# Altium schematic sheet FPGA Supply.SchDoc: SVPXFMC Carrier 3U
size 420 x 297 mm; CheckedBy: \; Author: G.Kasprowicz; CompanyName: ISE; DrawnBy: T.Przywozki; Organization: WUT ISE; Address1: Warsaw University of Technology; Address2: Nowowiejska 15/19 00-665 Warsaw; Revision: 1.0.; SheetNumber: 6; SheetTotal: 20; Projet: SVPXFMC Carrier 3U; ModifiedBy: -; CheckedDate: -; Title2: FPGA Supply; DivGrp: ISE; Designer: G. Kasprowicz; Project: SVPXFMC Carrier 3U
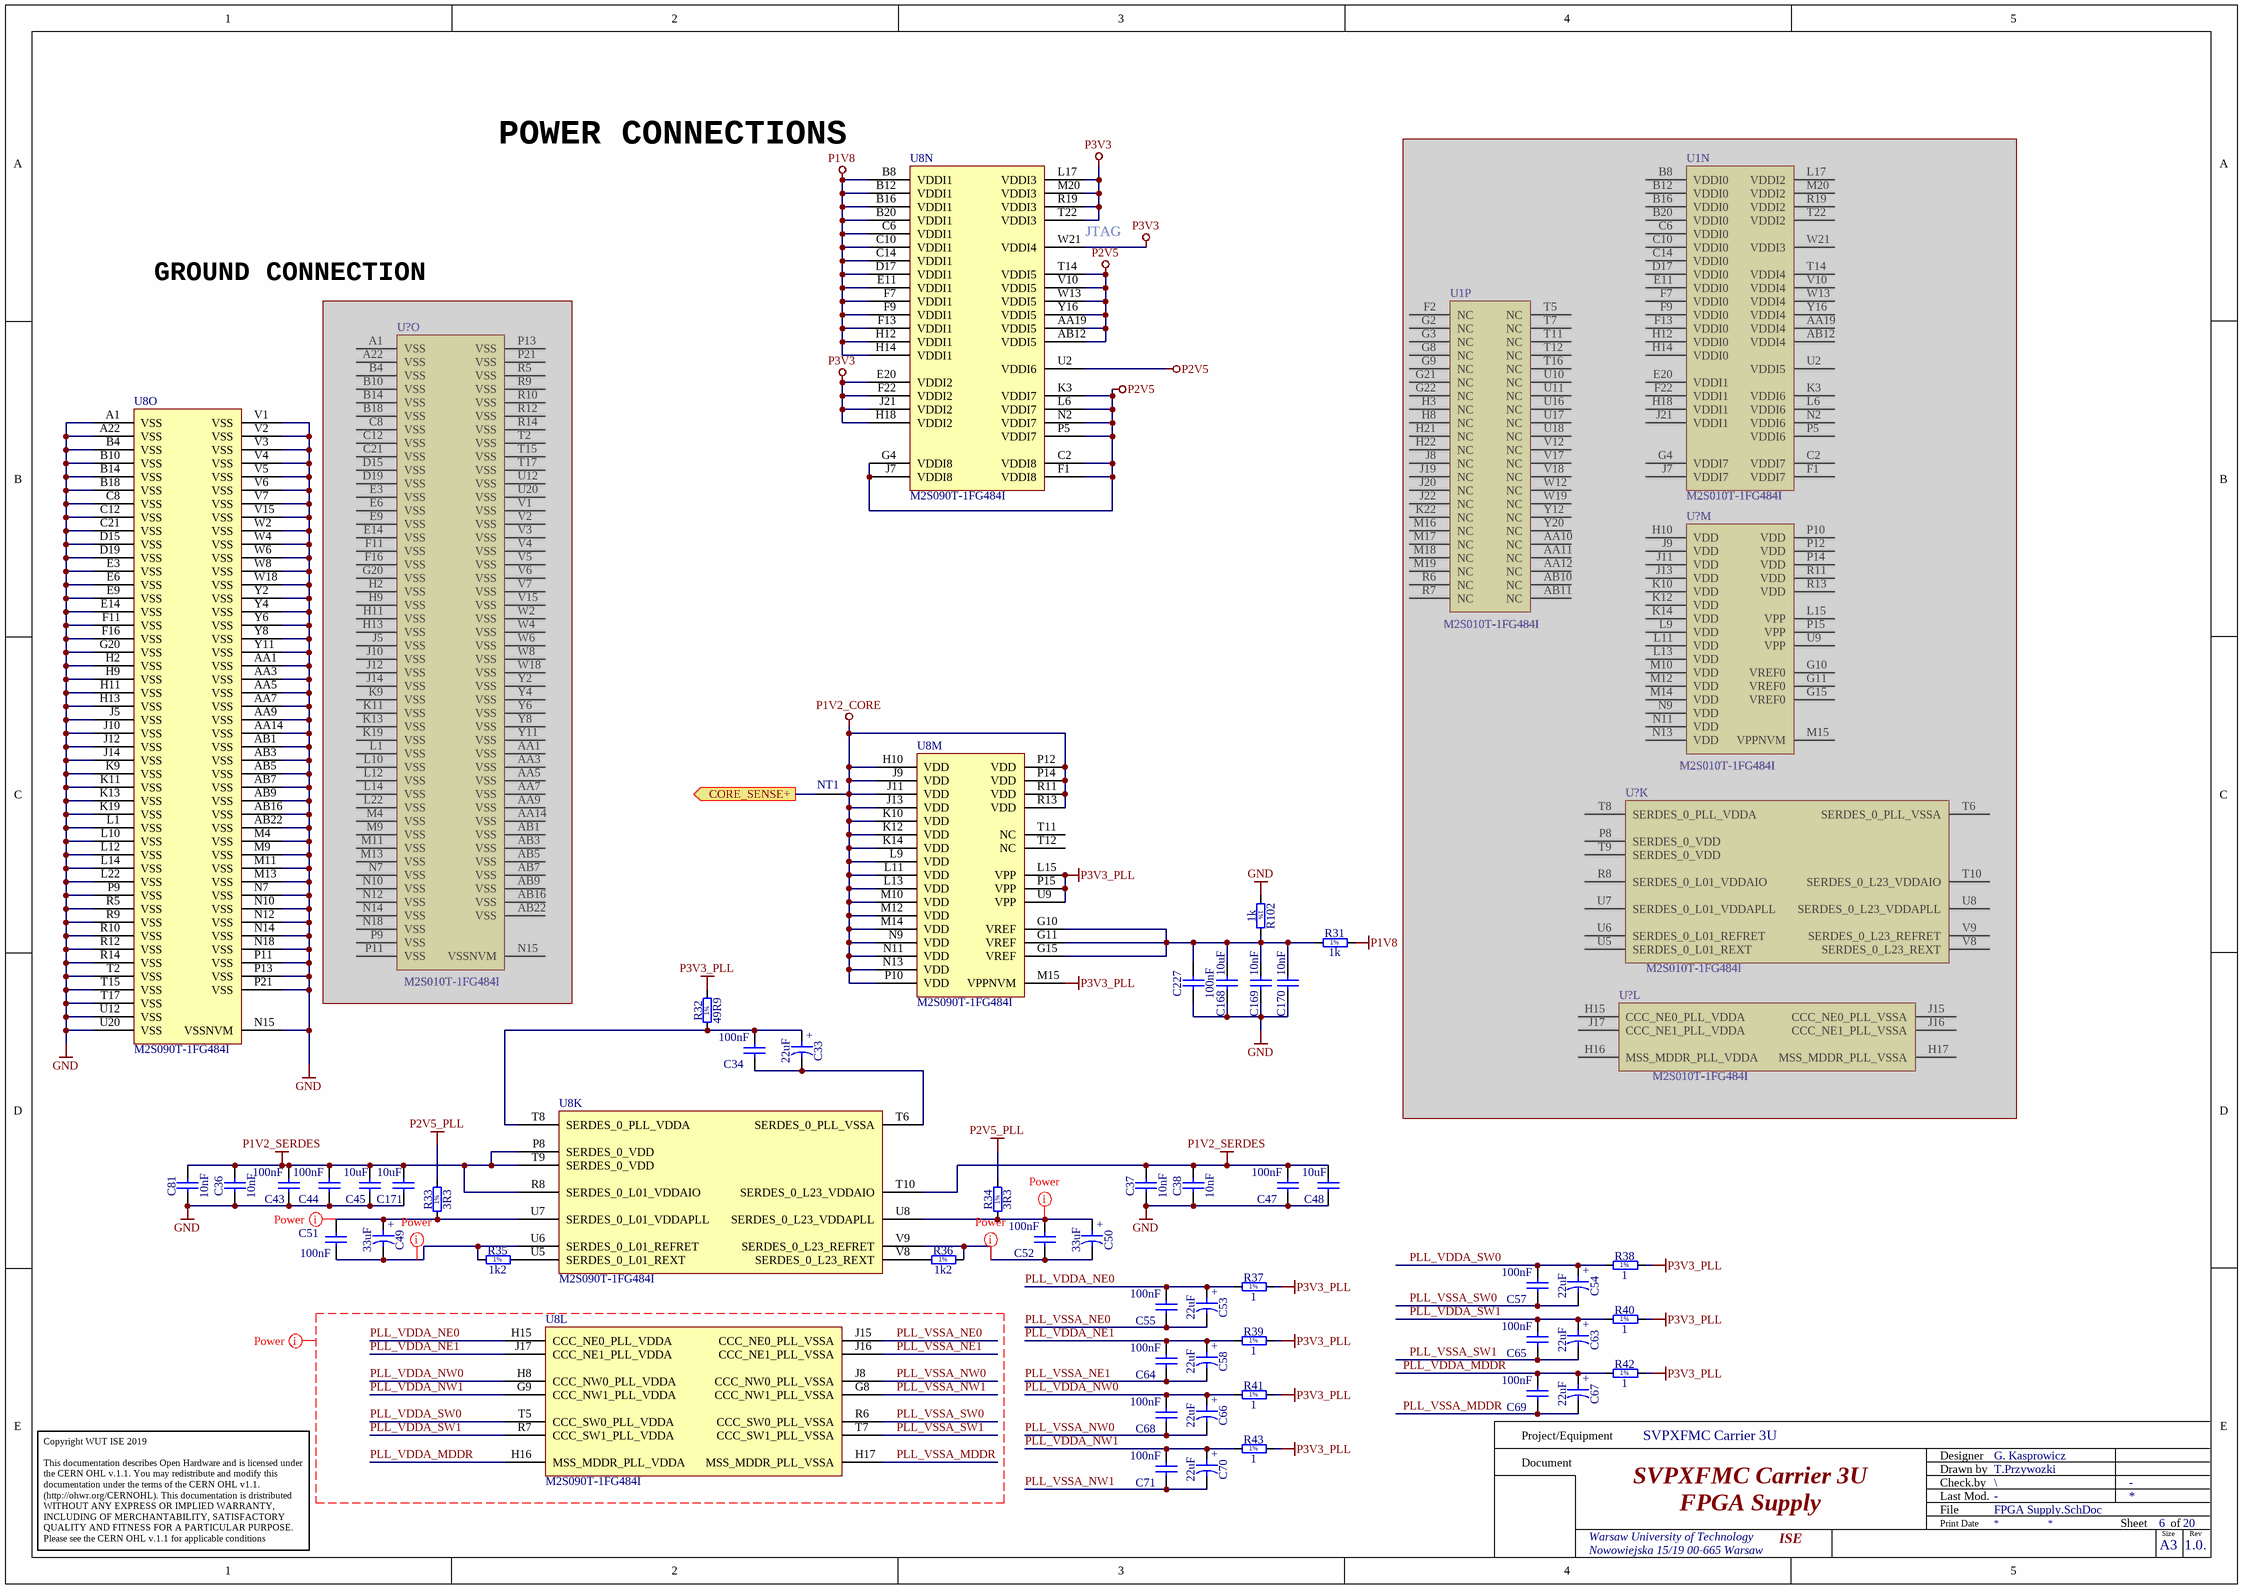
[diagram p0: FPGA Supply.SchDoc]

## Parts
(Parts that share a designator on the sheet are numbered #1, #2 ... from top to bottom, then left to right.)
C33  22uF  [CAPMP3216X180N]
C34  100nF  [CAPC0603X33N]
C36  10nF  [CAPC1005X55N]
C37  10nF  [CAPC1005X55N]
C38  10nF  [CAPC1005X55N]
C43  100nF  [CAPC0603X33N]
C44  100nF  [CAPC0603X33N]
C45  10uF  [CAPC1608X80N]
C47  100nF  [CAPC0603X33N]
C48  10uF  [CAPC1608X80N]
C49  33uF  [CAPMP3216X180N]
C50  33uF  [CAPMP3216X180N]
C51  100nF  [CAPC0603X33N]
C52  100nF  [CAPC0603X33N]
C53  22uF  [CAPMP3216X180N]
C54  22uF  [CAPMP3216X180N]
C55  100nF  [CAPC0603X33N]
C57  100nF  [CAPC0603X33N]
C58  22uF  [CAPMP3216X180N]
C63  22uF  [CAPMP3216X180N]
C64  100nF  [CAPC0603X33N]
C65  100nF  [CAPC0603X33N]
C66  22uF  [CAPMP3216X180N]
C67  22uF  [CAPMP3216X180N]
C68  100nF  [CAPC0603X33N]
C69  100nF  [CAPC0603X33N]
C70  22uF  [CAPMP3216X180N]
C71  100nF  [CAPC0603X33N]
C81  10nF  [CAPC1005X55N]
C168  10uF  [CAPC1608X80N]
C169  10nF  [CAPC0603X33N]
C170  10nF  [CAPC0603X33N]
C171  10uF  [CAPC1608X80N]
C227  100nF  [CAPC0603X33N]
NT1  Net Tie  [Net Tie]  (value not drawn)  (net tie, no BOM)
R31  1k  [RESC1005X40N]
R32  49R9  [RESC1005X40N]
R33  3R3  [RESC1005X40N]
R34  3R3  [RESC1005X40N]
R35  1k2  [RESC1005X40N]
R36  1k2  [RESC1005X40N]
R37  1  [RESC1005X40N]
R38  1  [RESC1005X40N]
R39  1  [RESC1005X40N]
R40  1  [RESC1005X40N]
R41  1  [RESC1005X40N]
R42  1  [RESC1005X40N]
R43  1  [RESC1005X40N]
R102  1k  [RESC1005X40N]
U1  M2S010T-1FG484I  [MCSM-FG-484_V]  (parts N,P of 16)  (masked out: inside a compile mask, not in the netlist)
U8  M2S090T-1FG484I  [MCSM-FG-484_V]  (parts K,L,M,N,O of 15)
U?#1  M2S010T-1FG484I  [MCSM-FG-484_V]  (part O of 16)  (masked out: inside a compile mask, not in the netlist)
U?#2  M2S010T-1FG484I  [MCSM-FG-484_V]  (part M of 16)  (masked out: inside a compile mask, not in the netlist)
U?#3  M2S010T-1FG484I  [MCSM-FG-484_V]  (part K of 16)  (masked out: inside a compile mask, not in the netlist)
U?#4  M2S010T-1FG484I  [MCSM-FG-484_V]  (part L of 16)  (masked out: inside a compile mask, not in the netlist)

## Ports
CORE_SENSE+ (out)

## Nets
GND: C36.1 C37.1 C38.1 C43.1 C44.1 C45.1 C47.1 C48.1 C81.1 C168.1 C169.1 C170.1 C171.1 C227.1 R102.1 U8.A1(VSS) U8.A22(VSS) U8.AA1(VSS) U8.AA3(VSS) U8.AA5(VSS) U8.AA7(VSS) U8.AA9(VSS) U8.AA14(VSS) U8.AB1(VSS) U8.AB3(VSS) U8.AB5(VSS) U8.AB7(VSS) U8.AB9(VSS) U8.AB16(VSS) U8.AB22(VSS) U8.B4(VSS) U8.B10(VSS) U8.B14(VSS) U8.B18(VSS) U8.C8(VSS) U8.C12(VSS) U8.C21(VSS) U8.D15(VSS) U8.D19(VSS) U8.E3(VSS) U8.E6(VSS) U8.E9(VSS) U8.E14(VSS) U8.F11(VSS) U8.F16(VSS) U8.G20(VSS) U8.H2(VSS) U8.H9(VSS) U8.H11(VSS) U8.H13(VSS) U8.J5(VSS) U8.J10(VSS) U8.J12(VSS) U8.J14(VSS) U8.K9(VSS) U8.K11(VSS) U8.K13(VSS) U8.K19(VSS) U8.L1(VSS) U8.L10(VSS) U8.L12(VSS) U8.L14(VSS) U8.L22(VSS) U8.M4(VSS) U8.M9(VSS) U8.M11(VSS) U8.M13(VSS) U8.N7(VSS) U8.N10(VSS) U8.N12(VSS) U8.N14(VSS) U8.N15(VSSNVM) U8.N18(VSS) U8.P9(VSS) U8.P11(VSS) U8.P13(VSS) U8.P21(VSS) U8.R5(VSS) U8.R9(VSS) U8.R10(VSS) U8.R12(VSS) U8.R14(VSS) U8.T2(VSS) U8.T15(VSS) U8.T17(VSS) U8.U12(VSS) U8.U20(VSS) U8.V1(VSS) U8.V2(VSS) U8.V3(VSS) U8.V4(VSS) U8.V5(VSS) U8.V6(VSS) U8.V7(VSS) U8.V15(VSS) U8.W2(VSS) U8.W4(VSS) U8.W6(VSS) U8.W8(VSS) U8.W18(VSS) U8.Y2(VSS) U8.Y4(VSS) U8.Y6(VSS) U8.Y8(VSS) U8.Y11(VSS)
P1V2_CORE: NT1.2 U8.H10(VDD) U8.J9(VDD) U8.J11(VDD) U8.J13(VDD) U8.K10(VDD) U8.K12(VDD) U8.K14(VDD) U8.L9(VDD) U8.L11(VDD) U8.L13(VDD) U8.M10(VDD) U8.M12(VDD) U8.M14(VDD) U8.N9(VDD) U8.N11(VDD) U8.N13(VDD) U8.P10(VDD) U8.P12(VDD) U8.P14(VDD) U8.R11(VDD) U8.R13(VDD)
P1V2_SERDES: C36.2 C37.2 C38.2 C43.2 C44.2 C45.2 C47.2 C48.2 C81.2 C171.2 U8.P8(SERDES_0_VDD) U8.R8(SERDES_0_L01_VDDAIO) U8.T9(SERDES_0_VDD) U8.T10(SERDES_0_L23_VDDAIO)
P1V8: R31.2 U8.B8(VDDI1) U8.B12(VDDI1) U8.B16(VDDI1) U8.B20(VDDI1) U8.C6(VDDI1) U8.C10(VDDI1) U8.C14(VDDI1) U8.D17(VDDI1) U8.E11(VDDI1) U8.F7(VDDI1) U8.F9(VDDI1) U8.F13(VDDI1) U8.H12(VDDI1) U8.H14(VDDI1)
P2V5: U8.AA19(VDDI5) U8.AB12(VDDI5) U8.C2(VDDI8) U8.F1(VDDI8) U8.G4(VDDI8) U8.J7(VDDI8) U8.K3(VDDI7) U8.L6(VDDI7) U8.N2(VDDI7) U8.P5(VDDI7) U8.T14(VDDI5) U8.U2(VDDI6) U8.V10(VDDI5) U8.W13(VDDI5) U8.Y16(VDDI5)
P2V5_PLL: R33.2 R34.2
P3V3: U8.E20(VDDI2) U8.F22(VDDI2) U8.H18(VDDI2) U8.J21(VDDI2) U8.L17(VDDI3) U8.M20(VDDI3) U8.R19(VDDI3) U8.T22(VDDI3) U8.W21(VDDI4)
P3V3_PLL: R32.2 R37.2 R38.2 R39.2 R40.2 R41.2 R42.2 R43.2 U8.L15(VPP) U8.M15(VPPNVM) U8.P15(VPP) U8.U9(VPP)
CORE_SENSE+: NT1.1 ; port CORE_SENSE+
PLL_VDDA_MDDR: C67.1 C69.2 R42.1 U8.H16(MSS_MDDR_PLL_VDDA)
PLL_VDDA_NE0: C53.1 C55.2 R37.1 U8.H15(CCC_NE0_PLL_VDDA)
PLL_VDDA_NE1: C58.1 C64.2 R39.1 U8.J17(CCC_NE1_PLL_VDDA)
PLL_VDDA_NW0: C66.1 C68.2 R41.1 U8.H8(CCC_NW0_PLL_VDDA)
PLL_VDDA_NW1: C70.1 C71.2 R43.1 U8.G9(CCC_NW1_PLL_VDDA)
PLL_VDDA_SW0: C54.1 C57.2 R38.1 U8.T5(CCC_SW0_PLL_VDDA)
PLL_VDDA_SW1: C63.1 C65.2 R40.1 U8.R7(CCC_SW1_PLL_VDDA)
PLL_VSSA_MDDR: C67.2 C69.1 U8.H17(MSS_MDDR_PLL_VSSA)
PLL_VSSA_NE0: C53.2 C55.1 U8.J15(CCC_NE0_PLL_VSSA)
PLL_VSSA_NE1: C58.2 C64.1 U8.J16(CCC_NE1_PLL_VSSA)
PLL_VSSA_NW0: C66.2 C68.1 U8.J8(CCC_NW0_PLL_VSSA)
PLL_VSSA_NW1: C70.2 C71.1 U8.G8(CCC_NW1_PLL_VSSA)
PLL_VSSA_SW0: C54.2 C57.1 U8.R6(CCC_SW0_PLL_VSSA)
PLL_VSSA_SW1: C63.2 C65.1 U8.T7(CCC_SW1_PLL_VSSA)
NetC33_1: C33.1 C34.2 R32.1 U8.T8(SERDES_0_PLL_VDDA)
NetC33_2: C33.2 C34.1 U8.T6(SERDES_0_PLL_VSSA)
NetC49_1: C49.1 C51.2 R33.1 U8.U7(SERDES_0_L01_VDDAPLL)
NetC49_2: C49.2 C51.1 R35.1 U8.U6(SERDES_0_L01_REFRET)
NetC50_1: C50.1 C52.2 R34.1 U8.U8(SERDES_0_L23_VDDAPLL)
NetC50_2: C50.2 C52.1 R36.2 U8.V9(SERDES_0_L23_REFRET)
NetC168_2: C168.2 C169.2 C170.2 C227.2 R31.1 R102.2 U8.G10(VREF) U8.G11(VREF) U8.G15(VREF)
NetR35_2: R35.2 U8.U5(SERDES_0_L01_REXT)
NetR36_1: R36.1 U8.V8(SERDES_0_L23_REXT)

Not connected (* = marked no-connect by the designer): U8 T11(NC) T12(NC)

## Layout directives
net class Power: NetC49_1, NetC49_2, NetC50_1, NetC50_2
net class Power; net class Power_CCC: PLL_VDDA_MDDR, PLL_VDDA_NE0, PLL_VDDA_NE1, PLL_VDDA_NW0, PLL_VDDA_NW1, PLL_VDDA_SW0, PLL_VDDA_SW1, PLL_VSSA_MDDR, PLL_VSSA_NE0, PLL_VSSA_NE1, PLL_VSSA_NW0, PLL_VSSA_NW1, PLL_VSSA_SW0, PLL_VSSA_SW1

## Notes on the sheet
- POWER CONNECTIONS
- (near U8) JTAG
- GROUND CONNECTION
- Project/Equipment
- Document
- Designer
- Drawn by
- Check.by
- File
- Last Mod.
- Print Date
- Sheet
- Size
- A3
- of
- Rev
- Copyright WUT ISE 2019
  This documentation describes Open Hardware and is licensed under the CERN OHL v.1.1. You may redistribute and modify this documentation under the terms of the CERN OHL v1.1.
  (http://ohwr.org/CERNOHL). This documentation is dristributed WITHOUT ANY EXPRESS OR IMPLIED WARRANTY, INCLUDING OF MERCHANTABILITY, SATISFACTORY QUALITY AND FITNESS FOR A PARTICULAR PURPOSE. Please see the CERN OHL v.1.1 for applicable conditions
- (in symbol CTE3216-18_22UF_10V_10%) +
- (in symbol CTE3216-18_33UF_4V_10%) +
- (in symbol R0402_1K2_1%_0.0625W_100PPM) 1%
- (in symbol R0402_1K_1%_0.0625W_100PPM) 1%
- (in symbol R0402_1R_1%_0.0625W_200PPM) 1%
- (in symbol R0402_3R3_1%_0.0625W_200PPM) 1%
- (in symbol R0402_49R9_1%_0.0625W_100PPM) 1%

## Library data of the parts
C33 C53 C54 C58 C63 C66 C67 C70 = CTE3216-18_22UF_10V_10%: Polarised capacitor; Part Description: Solid Tantalum Chip Capacitor; Manufacturer: GENERIC; Manufacturer1 Part Number: TAJA226K010R; Voltage: 10V; Tolerance: ±10%; Part Number: CTE3216-18_22UF_10V_10%; Component Kind: Standard; Component Type: Standard; Pin Count: 2; Value: 22uF; Status: Preferred; Manufacturer Part Number: CTE3216-18_22UF_10V_10%; Case: A; Mounted: Yes; Socket: No; SMD: Yes; Sense: No; Manufacturer1 Example: AVX; Manufacturer1 ComponentHeight: 1.8mm; HelpURL: \\cern.ch\dfs\Applications\Altium\Datasheets\CTE_AVX_TAJ.pdf; Author: CERN DEM JLC; CreateDate: 03/12/2007; LatestRevisionDate: 03/12/2007
C34 C43 C44 C47 C51 C52 C55 C57 C64 C65 C68 C69 C71 C227 = CC0201_100NF_6.3V_10%_X5R: Non-polarised capacitor; Manufacturer: GENERIC; Part Description: SMD Multilayer Chip Ceramic Capacitor; Manufacturer1 Part Number: 02016D104KAT2A; Voltage: 6.3V; TC: X5R; Tolerance: ±10%; Part Number: CC0201_100NF_6.3V_10%_X5R; Component Kind: Standard; Component Type: Standard; Pin Count: 2; Value: 100nF; Status: Not Recommended; Manufacturer Part Number: CC0201_100NF_6.3V_10%_X5R; Case: 0201; Mounted: Yes; Socket: No; SMD: Yes; Sense: No; Manufacturer1 Example: AVX; Manufacturer1 ComponentHeight: 0.33mm; HelpURL: \\cern.ch\dfs\Applications\Altium\Datasheets\CC0201_X5R_AVX.pdf; Author: CERN DEM JLC; CreateDate: 03/12/2007; LatestRevisionDate: 03/12/2007
C36-C38 C81 = CC0402_10NF_25V_10%_X7R: Non-polarised capacitor; Part Description: SMD Multilayer Chip Ceramic Capacitor; Manufacturer: GENERIC; Manufacturer1 Part Number: C1005X7R1E103KT; Voltage: 25V; TC: X7R; Tolerance: ±10%; Part Number: CC0402_10NF_25V_10%_X7R; Component Kind: Standard; Component Type: Standard; Pin Count: 2; Value: 10nF; Status: Preferred; Manufacturer Part Number: CC0402_10NF_25V_10%_X7R; Case: 0402; Mounted: Yes; Socket: No; SMD: Yes; Sense: No; Manufacturer1 Example: TDK; Manufacturer1 ComponentHeight: 0.55mm; HelpURL: \\cern.ch\dfs\Applications\Altium\Datasheets\CC0402_X7R_TDK_C.pdf; Author: CERN DEM JLC; CreateDate: 25/10/2012; LatestRevisionDate: 25/10/2012
C45 C48 C171 = CC0603_10UF_10V_10%_X5R: Non-polarised capacitor; Manufacturer: GENERIC; Part Description: SMD Multilayer Chip Ceramic Capacitor; Manufacturer1 Part Number: GRM188R61A106KE69D; Voltage: 10V; TC: X5R; Tolerance: ±10%; Part Number: CC0603_10UF_10V_10%_X5R; Component Kind: Standard; Component Type: Standard; Pin Count: 2; Value: 10uF; Status: None; Manufacturer Part Number: CC0603_10UF_10V_10%_X5R; Case: 0603; Mounted: Yes; Socket: No; SMD: Yes; Sense: No; Manufacturer1 Example: MURATA; Manufacturer1 ComponentHeight: 0.8mm; HelpURL: \\cern.ch\dfs\Applications\Altium\Datasheets\CC0603_MURATA_GRM188R61A106KE69D.pdf; Author: CERN DEM JLC; CreateDate: 31/01/2017; LatestRevisionDate: 31/01/2017
C49 C50 = CTE3216-18_33UF_4V_10%: Polarised capacitor; Part Description: Solid Tantalum Chip Capacitor; Manufacturer: GENERIC; Manufacturer1 Part Number: TAJA336K004R; Voltage: 4V; Tolerance: ±10%; Part Number: CTE3216-18_33UF_4V_10%; Component Kind: Standard; Component Type: Standard; Pin Count: 2; Value: 33uF; Status: Preferred; Manufacturer Part Number: CTE3216-18_33UF_4V_10%; Case: A; Mounted: Yes; Socket: No; SMD: Yes; Sense: No; Manufacturer1 Example: AVX; Manufacturer1 ComponentHeight: 1.8mm; HelpURL: \\cern.ch\dfs\Applications\Altium\Datasheets\CTE_AVX_TAJ.pdf; Author: CERN DEM JLC; CreateDate: 03/12/2007; LatestRevisionDate: 03/12/2007
C168 = CC0603_10UF_10V_10%_X5R: Non-polarised capacitor; Part Description: SMD Multilayer Chip Ceramic Capacitor; Manufacturer: GENERIC; Manufacturer1 Part Number: GRM188R61A106KE69D; Voltage: 10V; TC: X5R; Tolerance: ±10%; Part Number: CC0603_10UF_10V_10%_X5R; Component Kind: Standard; Component Type: Standard; Pin Count: 2; Value: 10uF; Status: None; Manufacturer Part Number: CC0603_10UF_10V_10%_X5R; Case: 0603; Mounted: Yes; Socket: No; SMD: Yes; Sense: No; Manufacturer1 Example: MURATA; Manufacturer1 ComponentHeight: 0.8mm; HelpURL: \\cern.ch\dfs\Applications\Altium\Datasheets\CC0603_MURATA_GRM188R61A106KE69D.pdf; Author: CERN DEM JLC; CreateDate: 31.01.2017; LatestRevisionDate: 31.01.2017
C169 C170 = CC0201_10NF_10V_10%_X5R: Non-polarised capacitor; Manufacturer: GENERIC; Part Description: SMD Multilayer Chip Ceramic Capacitor; Manufacturer1 Part Number: 0201ZD103KAT2A; Voltage: 10V; TC: X5R; Tolerance: ±10%; Part Number: CC0201_10NF_10V_10%_X5R; Component Kind: Standard; Component Type: Standard; Pin Count: 2; Value: 10nF; Status: Not Recommended; Manufacturer Part Number: CC0201_10NF_10V_10%_X5R; Case: 0201; Mounted: Yes; Socket: No; SMD: Yes; Sense: No; Manufacturer1 Example: AVX; Manufacturer1 ComponentHeight: 0.33mm; HelpURL: \\cern.ch\dfs\Applications\Altium\Datasheets\CC0201_X5R_AVX.pdf; Author: CERN DEM JLC; CreateDate: 03/12/2007; LatestRevisionDate: 03/12/2007
NT1 = Net Tie: Part Description: Net Tie (2 Nets); Mounted: No; Part Number: Net Tie; Component Type: Net Tie; Pin Count: 2; Family: Net Tie; Socket: No; SMD: No; Sense: No; Status: None; ComponentHeight: 0mm; HelpURL: Undefined; Author: CERN DEM JLC; CreateDate: 22/03/2011; LatestRevisionDate: 22/03/2011; PackageDescription: 2 Plated Through Hole For Coaxial Cable Link: Hole Dia.=1.4mm Pad Dia.=2.5mm
R31 R102 = R0402_1K_1%_0.0625W_100PPM: Resistor - 1%; Part Description: General Purpose Thick Film Chip Resistor; Manufacturer: GENERIC; Manufacturer1 Part Number: 232270671002L; TC: ±100ppm/°C; PressFit: No; Part Number: R0402_1K_1%_0.0625W_100PPM; Component Kind: Standard; Component Type: Standard; Pin Count: 2; Value: 1k; Status: Not Recommended; Power: 0.0625W; Tolerance: ±1%; Manufacturer Part Number: R0402_1K_1%_0.0625W_100PPM; Case: 0402; Mounted: Yes; Sense: No; Socket: No; SMD: Yes; Manufacturer1 Example: YAGEO PHYCOMP; Manufacturer1 ComponentHeight: 0.4mm; HelpURL: \\cern.ch\dfs\Applications\Altium\Datasheets\R0402_Phycomp_RC0402.pdf; Author: CERN DEM JLC; CreateDate: 03.12.2007; LatestRevisionDate: 17.10.2012
R32 = R0402_49R9_1%_0.0625W_100PPM: Resistor - 1%; Part Description: General Purpose Thick Film Chip Resistor; Manufacturer: GENERIC; Manufacturer1 Part Number: 232270674999L or RC0402FR-0749R9L; TC: ±100ppm/°C; PressFit: No; Part Number: R0402_49R9_1%_0.0625W_100PPM; Component Kind: Standard; Component Type: Standard; Pin Count: 2; Value: 49R9; Status: Not Recommended; Power: 0.0625W; Tolerance: ±1%; Manufacturer Part Number: R0402_49R9_1%_0.0625W_100PPM; Case: 0402; Mounted: Yes; Sense: No; Socket: No; SMD: Yes; Manufacturer1 Example: YAGEO PHYCOMP; Manufacturer1 ComponentHeight: 0.4mm; HelpURL: \\cern.ch\dfs\Applications\Altium\Datasheets\R0402_Phycomp_RC0402.pdf; Author: CERN DEM JLC; CreateDate: 24/10/2012; LatestRevisionDate: 24/10/2012
R33 R34 = R0402_3R3_1%_0.0625W_200PPM: Resistor - 1%; Part Description: General Purpose Thick Film Chip Resistor; Manufacturer: GENERIC; Manufacturer1 Part Number: 232270673308L; TC: ±200ppm/°C; PressFit: No; Part Number: R0402_3R3_1%_0.0625W_200PPM; Component Kind: Standard; Component Type: Standard; Pin Count: 2; Value: 3R3; Status: Not Recommended; Power: 0.0625W; Tolerance: ±1%; Manufacturer Part Number: R0402_3R3_1%_0.0625W_200PPM; Case: 0402; Mounted: Yes; Sense: No; Socket: No; SMD: Yes; Manufacturer1 Example: YAGEO PHYCOMP; Manufacturer1 ComponentHeight: 0.4mm; HelpURL: \\cern.ch\dfs\Applications\Altium\Datasheets\R0402_Phycomp_RC0402.pdf; Author: CERN DEM JLC; CreateDate: 03/12/2007; LatestRevisionDate: 17/10/2012
R35 R36 = R0402_1K2_1%_0.0625W_100PPM: Resistor - 1%; Part Description: General Purpose Thick Film Chip Resistor; Manufacturer: GENERIC; Manufacturer1 Part Number: 232270671202L; TC: ±100ppm/°C; PressFit: No; Part Number: R0402_1K2_1%_0.0625W_100PPM; Component Kind: Standard; Component Type: Standard; Pin Count: 2; Value: 1k2; Status: Not Recommended; Power: 0.0625W; Tolerance: ±1%; Manufacturer Part Number: R0402_1K2_1%_0.0625W_100PPM; Case: 0402; Mounted: Yes; Sense: No; Socket: No; SMD: Yes; Manufacturer1 Example: YAGEO PHYCOMP; Manufacturer1 ComponentHeight: 0.4mm; HelpURL: \\cern.ch\dfs\Applications\Altium\Datasheets\R0402_Phycomp_RC0402.pdf; Author: CERN DEM JLC; CreateDate: 03/12/2007; LatestRevisionDate: 17/10/2012
R37-R43 = R0402_1R_1%_0.0625W_200PPM: Resistor - 1%; Part Description: General Purpose Thick Film Chip Resistor; Manufacturer: GENERIC; Manufacturer1 Part Number: 232270671008L; TC: ±200ppm/°C; PressFit: No; Part Number: R0402_1R_1%_0.0625W_200PPM; Component Kind: Standard; Component Type: Standard; Pin Count: 2; Value: 1; Status: Not Recommended; Power: 0.0625W; Tolerance: ±1%; Manufacturer Part Number: R0402_1R_1%_0.0625W_200PPM; Case: 0402; Mounted: Yes; Sense: No; Socket: No; SMD: Yes; Manufacturer1 Example: YAGEO PHYCOMP; Manufacturer1 ComponentHeight: 0.4mm; HelpURL: \\cern.ch\dfs\Applications\Altium\Datasheets\R0402_Phycomp_RC0402.pdf; Author: CERN DEM JLC; CreateDate: 03/12/2007; LatestRevisionDate: 17/10/2012
U1 U?#1-U?#4 = CMP-0959-00069-1: SmartFusion2 SoC FPGA, ARM Cortex-M3, 10 K LUTs, 233 User I/O, Transceiver Available, Design Security, Speed Grade 1, -40 to 100 degC, 484-Ball BGA; Manufacturer: Microsemi; MSIO (3.3V): 123; DDRIO (2.5V): 70; eSRAM (K Bytes): 64; uSRAM1K Blocks: 22; SERDES Lanes: 4; DDR Controllers (Count x Width): 1x18; MSIOD (2.5V): 40; Maximum Logic Elements: 12,084; eNVM (K Bytes): 256; PLLs and CCCs: 2; LSRAM 18K Blocks: 21; eSRAM (K Bytes) Non SECDED: 80; Total RAM (K bits): 400; Total User I/O: 233; PackageVersion: Rev. 48, 11/2013; ComponentLink3URL: http://www.microsemi.com/document-portal/doc_download/131095-package-mechanical-drawings; ComponentLink1Description: Manufacturer URL; DatasheetVersion: Rev. 5; RoHS: FALSE; ComponentLink2Description: Datasheet; Code_JEDEC: MS-034; ComponentLink3Description: Package Specification; ComponentLink2URL: http://www.microsemi.com/document-portal/doc_download/130717-smartfusion2-datasheet; PartNumber: M2S010T-1FG484I; ComponentLink1URL: http://www.microsemi.com/; Math Blocks (18x18): 22; Mounting Technology: Surface Mount; PackageDescription: 484-Ball Fine Pitch Plastic Ball Grid Array (FBGA), Body 23 x 23 mm, Pitch 1 mm; PackageReference: FG-484
U8 = CMP-0959-00045-1: SmartFusion2 SoC FPGA, ARM Cortex-M3, 90 K LUTs, 267 User I/O, Transceiver Available, Design Security, Speed Grade 1, -40 to 100 degC, 484-Ball BGA; Manufacturer: Microsemi; Total User I/O: 267; PLLs and CCCs: 6; LSRAM 18K Blocks: 109; eNVM (K Bytes): 512; DDR Controllers (Count x Width): 1x18; Math Blocks (18x18): 84; Maximum Logic Elements: 86,316; eSRAM (K Bytes): 64; MSIOD (2.5V): 40; SERDES Lanes: 4; MSIO (3.3V): 157; Total RAM (K bits): 2074; DDRIO (2.5V): 70; uSRAM1K Blocks: 112; eSRAM (K Bytes) Non SECDED: 80; ComponentLink3URL: http://www.microsemi.com/document-portal/doc_download/131095-package-mechanical-drawings; DatasheetVersion: Rev. 5; ComponentLink3Description: Package Specification; ComponentLink1Description: Manufacturer URL; PackageReference: FG-484; RoHS: FALSE; ComponentLink1URL: http://www.microsemi.com/; Code_JEDEC: MS-034; Mounting Technology: Surface Mount; PackageDescription: 484-Ball Fine Pitch Plastic Ball Grid Array (FBGA), Body 23 x 23 mm, Pitch 1 mm; PackageVersion: Rev. 48, 11/2013; ComponentLink2URL: http://www.microsemi.com/document-portal/doc_download/130717-smartfusion2-datasheet; PartNumber: M2S090T-1FG484I; ComponentLink2Description: Datasheet; PartId: 1